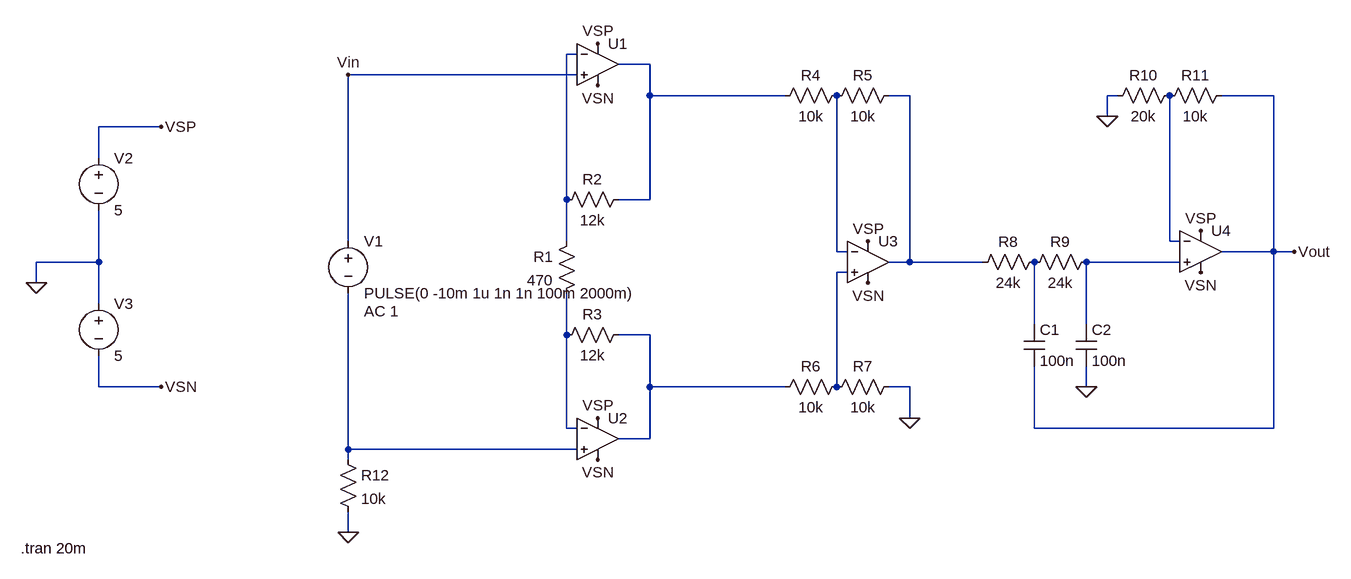
[diagram p0: schematic ex3_artiom.asc]
ex3_artiom.asc, the LTspice schematic file:
Version 4
SHEET 1 1896 680
WIRE 720 -128 704 -128
WIRE 832 -112 784 -112
WIRE 720 -96 368 -96
WIRE 832 -64 832 -112
WIRE 1040 -64 832 -64
WIRE 1232 -64 1200 -64
WIRE 1552 -64 1536 -64
WIRE 1792 -64 1712 -64
WIRE 1536 -32 1536 -64
WIRE 80 -16 -16 -16
WIRE -16 32 -16 -16
WIRE 704 96 704 -128
WIRE 832 96 832 -64
WIRE 832 96 784 96
WIRE 368 160 368 -96
WIRE 704 160 704 96
WIRE 1632 160 1632 -64
WIRE 1648 160 1632 160
WIRE 1120 176 1120 -64
WIRE 1136 176 1120 176
WIRE 1792 176 1792 -64
WIRE 1792 176 1712 176
WIRE 1824 176 1792 176
WIRE -16 192 -16 112
WIRE -16 192 -112 192
WIRE 1232 192 1232 -64
WIRE 1232 192 1200 192
WIRE 1344 192 1232 192
WIRE 1648 192 1504 192
WIRE 1136 208 1120 208
WIRE -112 224 -112 192
WIRE -16 256 -16 192
WIRE 1424 288 1424 192
WIRE 1504 288 1504 192
WIRE 704 304 704 240
WIRE 832 304 784 304
WIRE -16 384 -16 336
WIRE 80 384 -16 384
WIRE 832 384 832 304
WIRE 1040 384 832 384
WIRE 1120 384 1120 208
WIRE 1232 384 1200 384
WIRE 1504 384 1504 352
WIRE 1232 432 1232 384
WIRE 704 448 704 304
WIRE 720 448 704 448
WIRE 1424 448 1424 352
WIRE 1792 448 1792 176
WIRE 1792 448 1424 448
WIRE 832 464 832 384
WIRE 832 464 784 464
WIRE 368 480 368 240
WIRE 720 480 368 480
WIRE 368 496 368 480
WIRE 368 608 368 576
FLAG -112 224 0
FLAG 80 -16 VSP
FLAG 80 384 VSN
FLAG 1232 432 0
FLAG 1504 384 0
FLAG 1536 -32 0
FLAG 368 608 0
FLAG 752 -144 VSP
FLAG 752 432 VSP
FLAG 1168 160 VSP
FLAG 1680 144 VSP
FLAG 752 -80 VSN
FLAG 752 496 VSN
FLAG 1168 224 VSN
FLAG 1680 208 VSN
FLAG 1824 176 Vout
FLAG 368 -96 Vin
SYMBOL voltage 368 144 R0
WINDOW 123 24 124 Left 2
WINDOW 39 0 0 Left 0
SYMATTR Value2 AC 1
SYMATTR InstName V1
SYMATTR Value PULSE(0 -10m 1u 1n 1n 100m 2000m)
SYMBOL voltage -16 16 R0
WINDOW 123 0 0 Left 0
WINDOW 39 0 0 Left 0
SYMATTR InstName V2
SYMATTR Value 5
SYMBOL voltage -16 240 R0
WINDOW 123 0 0 Left 0
WINDOW 39 0 0 Left 0
SYMATTR InstName V3
SYMATTR Value 5
SYMBOL res 720 144 M0
SYMATTR InstName R1
SYMATTR Value 470
SYMBOL res 800 80 R90
WINDOW 0 0 56 VBottom 2
WINDOW 3 32 56 VTop 2
SYMATTR InstName R2
SYMATTR Value 12k
SYMBOL res 800 288 R90
WINDOW 0 0 56 VBottom 2
WINDOW 3 32 56 VTop 2
SYMATTR InstName R3
SYMATTR Value 12k
SYMBOL OpAmps\\UniversalOpAmp2 752 -112 R0
SYMATTR InstName U1
SYMBOL OpAmps\\UniversalOpAmp2 752 464 R0
SYMATTR InstName U2
SYMBOL res 1136 -80 R90
WINDOW 0 0 56 VBottom 2
WINDOW 3 32 56 VTop 2
SYMATTR InstName R4
SYMATTR Value 10k
SYMBOL res 1216 -80 R90
WINDOW 0 0 56 VBottom 2
WINDOW 3 32 56 VTop 2
SYMATTR InstName R5
SYMATTR Value 10k
SYMBOL res 1136 368 R90
WINDOW 0 0 56 VBottom 2
WINDOW 3 32 56 VTop 2
SYMATTR InstName R6
SYMATTR Value 10k
SYMBOL res 1216 368 R90
WINDOW 0 0 56 VBottom 2
WINDOW 3 32 56 VTop 2
SYMATTR InstName R7
SYMATTR Value 10k
SYMBOL OpAmps\\UniversalOpAmp2 1168 192 R0
SYMATTR InstName U3
SYMBOL res 1440 176 R90
WINDOW 0 0 56 VBottom 2
WINDOW 3 32 56 VTop 2
SYMATTR InstName R8
SYMATTR Value 24k
SYMBOL res 1520 176 R90
WINDOW 0 0 56 VBottom 2
WINDOW 3 32 56 VTop 2
SYMATTR InstName R9
SYMATTR Value 24k
SYMBOL cap 1408 288 R0
SYMATTR InstName C1
SYMATTR Value 100n
SYMBOL cap 1488 288 R0
SYMATTR InstName C2
SYMATTR Value 100n
SYMBOL OpAmps\\UniversalOpAmp2 1680 176 R0
SYMATTR InstName U4
SYMBOL res 1648 -80 R90
WINDOW 0 0 56 VBottom 2
WINDOW 3 32 56 VTop 2
SYMATTR InstName R10
SYMATTR Value 20k
SYMBOL res 1728 -80 R90
WINDOW 0 0 56 VBottom 2
WINDOW 3 32 56 VTop 2
SYMATTR InstName R11
SYMATTR Value 10k
SYMBOL res 352 480 R0
SYMATTR InstName R12
SYMATTR Value 10k
TEXT -136 632 Left 2 !.tran 20m

The netlist it stands for:
* ex3_artiom.asc
V1 Vin N011 PULSE(0 -10m 1u 1n 1n 100m 2000m) AC 1
V2 VSP 0 5
V3 0 VSN 5
R1 N001 N009 470
R2 N002 N001 12k
R3 N010 N009 12k
XU1 Vin N001 VSP VSN N002 level2 Avol=1Meg GBW=10Meg Slew=10Meg Ilimit=25m Rail=0 Vos=0 En=0 Enk=0 In=0 Ink=0 Rin=500Meg  ; pins In+ In- V+ V- OUT
XU2 N011 N009 VSP VSN N010 level2 Avol=1Meg GBW=10Meg Slew=10Meg Ilimit=25m Rail=0 Vos=0 En=0 Enk=0 In=0 Ink=0 Rin=500Meg  ; pins In+ In- V+ V- OUT
R4 N005 N002 10k
R5 N003 N005 10k
R6 N007 N010 10k
R7 0 N007 10k
XU3 N007 N005 VSP VSN N003 level2 Avol=1Meg GBW=10Meg Slew=10Meg Ilimit=25m Rail=0 Vos=0 En=0 Enk=0 In=0 Ink=0 Rin=500Meg  ; pins In+ In- V+ V- OUT
R8 N008 N003 24k
R9 N006 N008 24k
C1 N008 Vout 100n
C2 N006 0 100n
XU4 N006 N004 VSP VSN Vout level2 Avol=1Meg GBW=10Meg Slew=10Meg Ilimit=25m Rail=0 Vos=0 En=0 Enk=0 In=0 Ink=0 Rin=500Meg  ; pins In+ In- V+ V- OUT
R10 N004 0 20k
R11 Vout N004 10k
R12 N011 0 10k
.tran 20m
.lib UniversalOpAmp2.lib
.backanno
.end